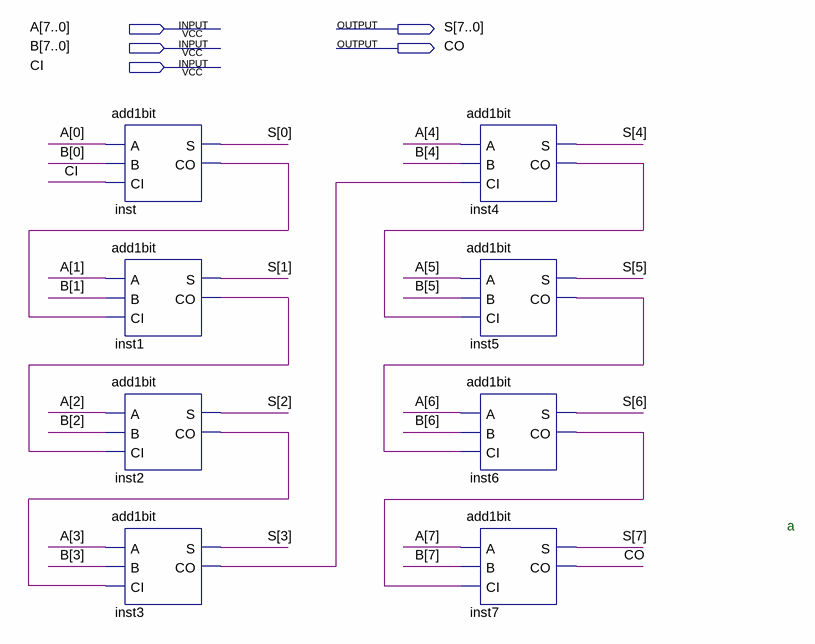
[diagram p0: schematic sheet]
// Quartus schematic add8bit.bdf as structural Verilog: 8 symbols, 5 pins
module add8bit (
  input  [7:0] A,
  input  [7:0] B,
  input  CI,
  output [7:0] S,
  output CO
);

  wire inst1_co, inst2_co, inst3_co, inst4_co, inst5_co, inst6_co, inst_co;

  add1bit inst (.A(A[0]), .B(B[0]), .CI(CI), .S(S[0]), .CO(inst_co));
  add1bit inst1 (.A(A[1]), .B(B[1]), .CI(inst_co), .S(S[1]), .CO(inst1_co));
  add1bit inst2 (.A(A[2]), .B(B[2]), .CI(inst1_co), .S(S[2]), .CO(inst2_co));
  add1bit inst3 (.A(A[3]), .B(B[3]), .CI(inst2_co), .S(S[3]), .CO(inst3_co));
  add1bit inst4 (.A(A[4]), .B(B[4]), .CI(inst3_co), .S(S[4]), .CO(inst4_co));
  add1bit inst5 (.A(A[5]), .B(B[5]), .CI(inst4_co), .S(S[5]), .CO(inst5_co));
  add1bit inst6 (.A(A[6]), .B(B[6]), .CI(inst5_co), .S(S[6]), .CO(inst6_co));
  add1bit inst7 (.A(A[7]), .B(B[7]), .CI(inst6_co), .S(S[7]), .CO(CO));

  // Notes on the sheet:
  //   a
endmodule
